# EAGLE design Pi-XMEGA (EAGLE 7.2.0)
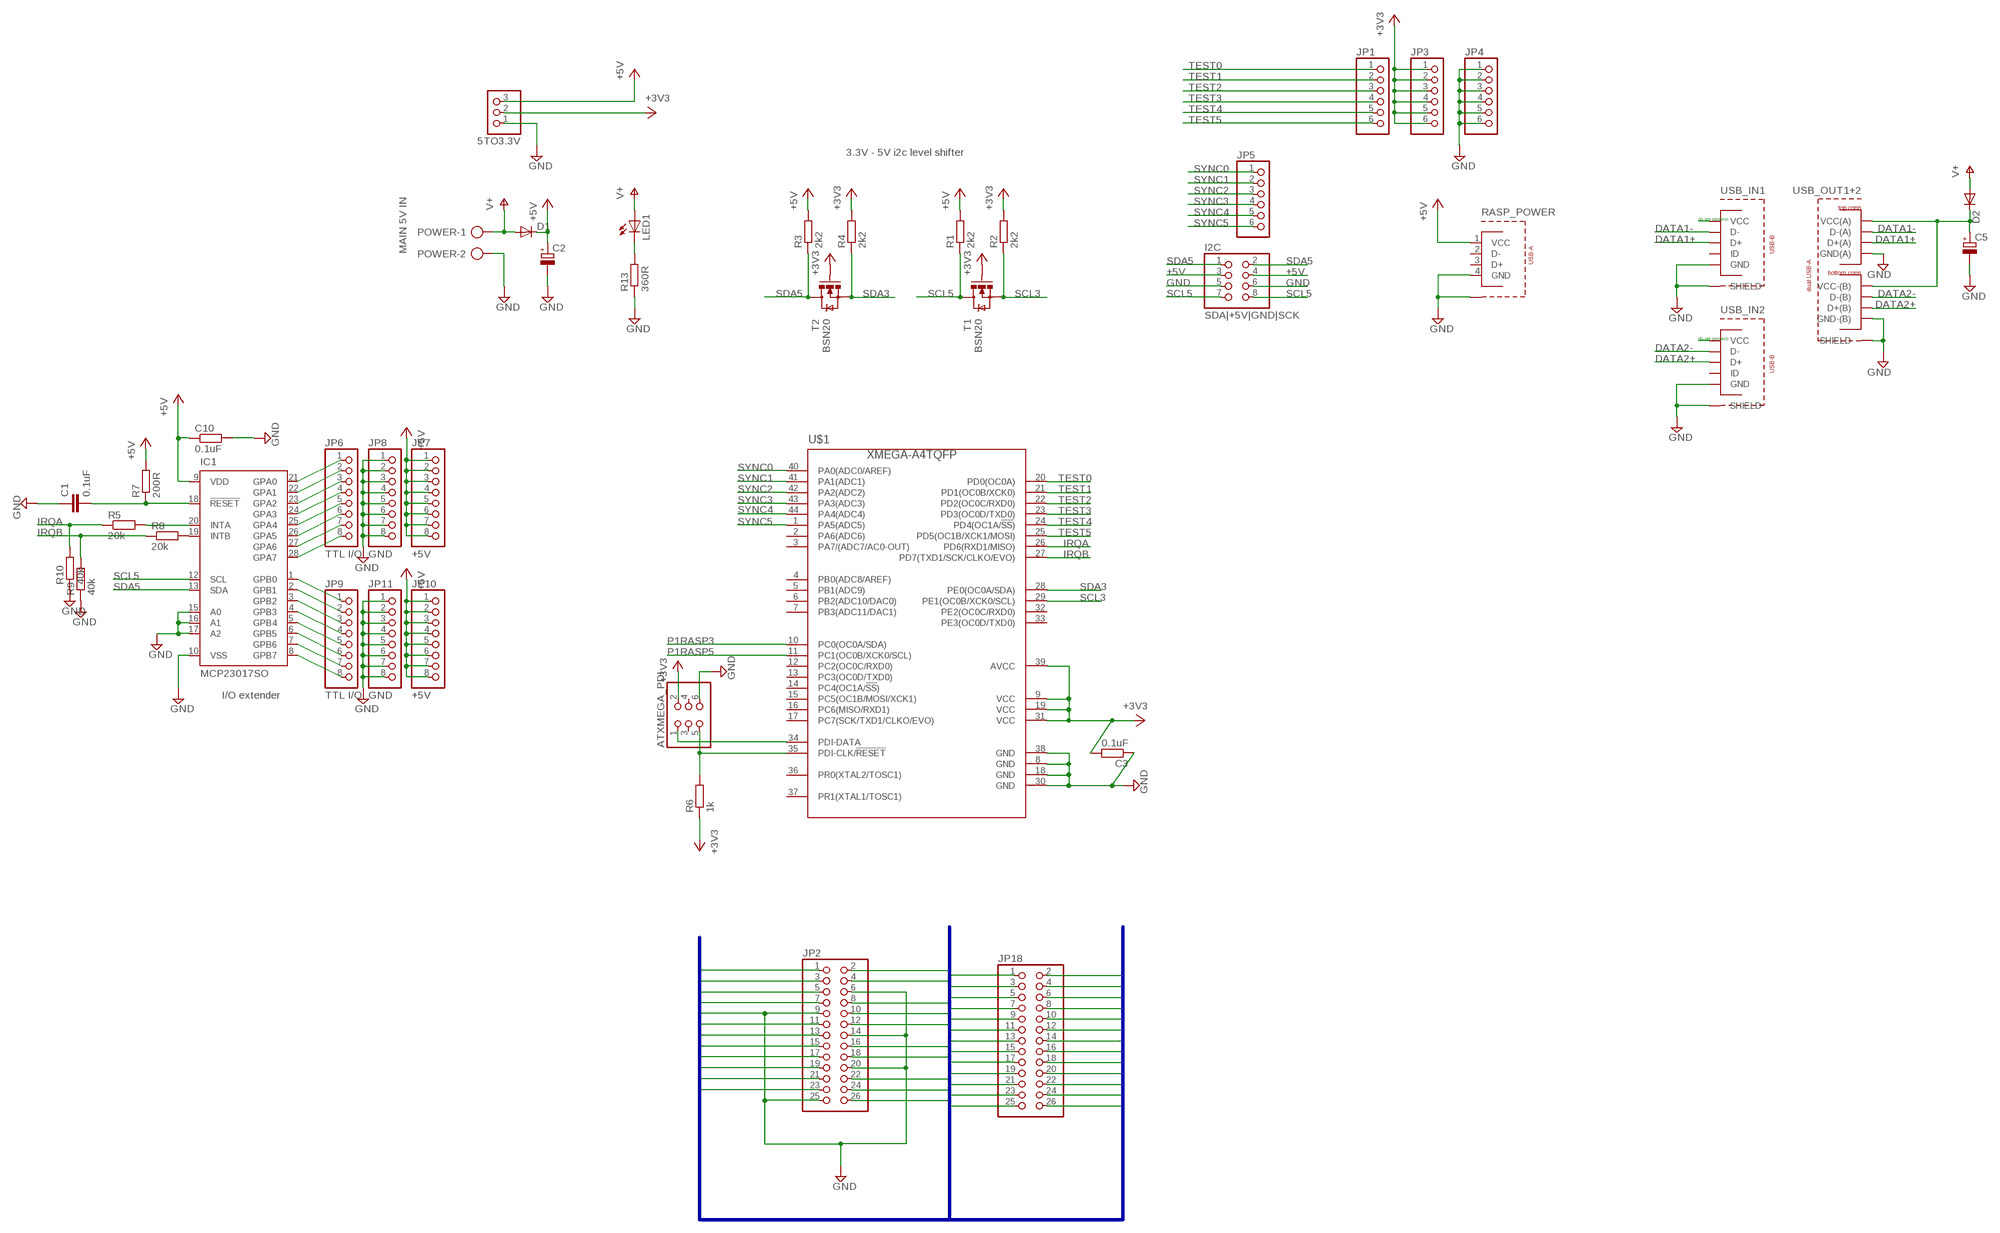
[diagram p0: schematic, sheet 1]

## Parts
5TO3.3V  PINHD-1X3  [1X03]
ATXMEGA_PDI  PINHD-2X03_2.54  [2X03]
C1  0.1uF  CAPACITORC-0805BIG  [0805BIG]
C2  CPOL-EUE5-8.5  [E5-8,5]
C3  0.1uF  RESISTORR-0805BIG  [0805BIG]
C5  CPOL-EUE5-8.5  [E5-8,5]
C10  0.1uF  RESISTORR-0805BIG  [0805BIG]
D1  DIODE-C1702-05  [C1702-05]
D2  DIODE-C1702-05  [C1702-05]
I2C  SDA|+5V|GND|SCK  PINHD-2X04_2.54  [2X04]
IC1  MCP23017SO  [SO28W]
JP1  PINHD-1X06_2.54-S  [1X06-S]
JP2  PINHD-2X13_2.54  [2X13]
JP3  PINHD-1X06_2.54-S  [1X06-S]
JP4  PINHD-1X06_2.54-S  [1X06-S]
JP5  PINHD-1X06_2.54-S  [1X06-S]
JP6  TTL I/O  PINHD-1X08_2.54-S  [1X08-S]
JP7  +5V  PINHD-1X08_2.54-S  [1X08-S]
JP8  GND  PINHD-1X08_2.54-S  [1X08-S]
JP9  TTL I/O  PINHD-1X08_2.54-S  [1X08-S]
JP10  +5V  PINHD-1X08_2.54-S  [1X08-S]
JP11  GND  PINHD-1X08_2.54-S  [1X08-S]
JP18  PINHD-2X13_2.54  [2X13]
LED1  LED3MM  [LED3MM]
POWER  AK500/2  [AK500/2]
R1  2k2  RESISTORR-0805BIG  [0805BIG]
R2  2k2  RESISTORR-0805BIG  [0805BIG]
R3  2k2  RESISTORR-0805BIG  [0805BIG]
R4  2k2  RESISTORR-0805BIG  [0805BIG]
R5  20k  RESISTORR-0805BIG  [0805BIG]
R6  1k  RESISTORR-0805BIG  [0805BIG]
R7  200R  RESISTORR-0805BIG  [0805BIG]
R8  20k  RESISTORR-0805BIG  [0805BIG]
R9  40k  RESISTORR-0805BIG  [0805BIG]
R10  40k  RESISTORR-0805BIG  [0805BIG]
R13  360R  RESISTORR-0805BIG  [0805BIG]
RASP_POWER  USB-A  [USB-A]
T1  BSN20  [SOT23]
T2  BSN20  [SOT23]
U$1  XMEGA-A4TQFP  [TQFP44]
USB_IN1  USB-B-MICRO  [USB-B-MICRO]
USB_IN2  USB-B-MICRO  [USB-B-MICRO]
USB_OUT1+2  DUAL-USB-A  [DUAL-USB-A]

## Nets
+3V3: 5TO3.3V.2 ATXMEGA_PDI.2 C3.2 JP3.1 JP3.2 JP3.3 JP3.4 JP3.5 JP3.6 R2.2 R4.2 R6.1 T1.1(G) T2.1(G) U$1.9(VCC) U$1.19(VCC) U$1.31(VCC) U$1.39(AVCC)
+5V: 5TO3.3V.3 C2.+ C10.1 D1.C I2C.3 I2C.4 IC1.9(VDD) JP7.1 JP7.2 JP7.3 JP7.4 JP7.5 JP7.6 JP7.7 JP7.8 JP10.1 JP10.2 JP10.3 JP10.4 JP10.5 JP10.6 JP10.7 JP10.8 R1.2 R3.2 R7.2 RASP_POWER.1(VCC)
DATA1+: USB_IN1.3(D+) USB_OUT1+2.3(D+(A))
DATA1-: USB_IN1.2(D-) USB_OUT1+2.2(D-(A))
DATA2+: USB_IN2.3(D+) USB_OUT1+2.7(D+(B))
DATA2-: USB_IN2.2(D-) USB_OUT1+2.6(D-(B))
GND: 5TO3.3V.1 ATXMEGA_PDI.6 C1.1 C2.- C3.1 C5.- C10.2 I2C.5 I2C.6 IC1.10(VSS) IC1.15(A0) IC1.16(A1) IC1.17(A2) JP2.6 JP2.9 JP2.14 JP2.20 JP2.25 JP4.1 JP4.2 JP4.3 JP4.4 JP4.5 JP4.6 JP8.1 JP8.2 JP8.3 JP8.4 JP8.5 JP8.6 JP8.7 JP8.8 JP11.1 JP11.2 JP11.3 JP11.4 JP11.5 JP11.6 JP11.7 JP11.8 JP18.6 JP18.9 JP18.14 JP18.20 JP18.25 POWER.2 R9.1 R10.1 R13.1 RASP_POWER.4(GND) RASP_POWER.S1(SHIELD) RASP_POWER.S2(SHIELD) U$1.8(GND) U$1.18(GND) U$1.30(GND) U$1.38(GND) USB_IN1.5(GND) USB_IN1.S1(SHIELD) USB_IN1.S2(SHIELD) USB_IN2.5(GND) USB_IN2.S1(SHIELD) USB_IN2.S2(SHIELD) USB_OUT1+2.4(GND(A)) USB_OUT1+2.8(GND-(B)) USB_OUT1+2.S1(SHIELD) USB_OUT1+2.S2(SHIELD) USB_OUT1+2.S3(SHIELD) USB_OUT1+2.S4(SHIELD)
IRQA: R5.1 R10.2 U$1.26(PD6(RXD1/MISO))
IRQB: R8.1 R9.2 U$1.27(PD7(TXD1/SCK/CLKO/EVO))
N$1: IC1.20(INTA) R5.2
N$2: IC1.19(INTB) R8.2
N$3: IC1.21(GPA0) JP6.1
N$7: IC1.22(GPA1) JP6.2
N$9: ATXMEGA_PDI.5 R6.2 U$1.35(PDI-CLK/!RESET)
N$10: IC1.23(GPA2) JP6.3
N$11: IC1.24(GPA3) JP6.4
N$12: IC1.25(GPA4) JP6.5
N$13: C1.2 IC1.18(!RESET) R7.1
N$14: IC1.26(GPA5) JP6.6
N$15: IC1.27(GPA6) JP6.7
N$16: IC1.28(GPA7) JP6.8
N$17: IC1.1(GPB0) JP9.1
N$18: IC1.2(GPB1) JP9.2
N$19: IC1.3(GPB2) JP9.3
N$20: IC1.4(GPB3) JP9.4
N$21: IC1.5(GPB4) JP9.5
N$22: IC1.6(GPB5) JP9.6
N$23: IC1.7(GPB6) JP9.7
N$24: IC1.8(GPB7) JP9.8
N$27: ATXMEGA_PDI.1 U$1.34(PDI-DATA)
N$71: LED1.K(C) R13.2
N$FAKE1: USB_IN1.1(VCC)
N$FAKE2: USB_IN2.1(VCC)
P1RASP1: JP2.1 JP18.1
P1RASP2: JP2.2 JP18.2
P1RASP3: JP2.3 JP18.3 U$1.10(PC0(OC0A/SDA))
P1RASP4: JP2.4 JP18.4
P1RASP5: JP2.5 JP18.5 U$1.11(PC1(OC0B/XCK0/SCL))
P1RASP7: JP2.7 JP18.7
P1RASP8: JP2.8 JP18.8
P1RASP10: JP2.10 JP18.10
P1RASP11: JP2.11 JP18.11
P1RASP12: JP2.12 JP18.12
P1RASP13: JP2.13 JP18.13
P1RASP15: JP2.15 JP18.15
P1RASP16: JP2.16 JP18.16
P1RASP17: JP2.17 JP18.17
P1RASP18: JP2.18 JP18.18
P1RASP19: JP2.19 JP18.19
P1RASP21: JP2.21 JP18.21
P1RASP22: JP2.22 JP18.22
P1RASP23: JP2.23 JP18.23
P1RASP24: JP2.24 JP18.24
P1RASP26: JP2.26 JP18.26
SCL3: R2.1 T1.2(S) U$1.29(PE1(OC0B/XCK0/SCL))
SCL5: I2C.7 I2C.8 IC1.12(SCL) R1.1 T1.3(D)
SDA3: R4.1 T2.2(S) U$1.28(PE0(OC0A/SDA))
SDA5: I2C.1 I2C.2 IC1.13(SDA) R3.1 T2.3(D)
SYNC0: JP5.1 U$1.40(PA0(ADC0/AREF))
SYNC1: JP5.2 U$1.41(PA1(ADC1))
SYNC2: JP5.3 U$1.42(PA2(ADC2))
SYNC3: JP5.4 U$1.43(PA3(ADC3))
SYNC4: JP5.5 U$1.44(PA4(ADC4))
SYNC5: JP5.6 U$1.1(PA5(ADC5))
TEST0: JP1.1 U$1.20(PD0(OC0A))
TEST1: JP1.2 U$1.21(PD1(OC0B/XCK0))
TEST2: JP1.3 U$1.22(PD2(OC0C/RXD0))
TEST3: JP1.4 U$1.23(PD3(OC0D/TXD0))
TEST4: JP1.5 U$1.24(PD4(OC1A/!SS!))
TEST5: JP1.6 U$1.25(PD5(OC1B/XCK1/MOSI))
USB+5V: C5.+ D2.C USB_OUT1+2.1(VCC(A)) USB_OUT1+2.5(VCC-(B))
V+: D1.A D2.A LED1.A POWER.1
Unconnected: ATXMEGA_PDI.3 ATXMEGA_PDI.4 RASP_POWER.2(D-) RASP_POWER.3(D+) U$1.2(PA6(ADC6)) U$1.3(PA7/(ADC7/AC0-OUT)) U$1.4(PB0(ADC8/AREF)) U$1.5(PB1(ADC9)) U$1.6(PB2(ADC10/DAC0)) U$1.7(PB3(ADC11/DAC1)) U$1.12(PC2(OC0C/RXD0)) U$1.13(PC3(OC0D/TXD0)) U$1.14(PC4(OC1A/!SS!)) U$1.15(PC5(OC1B/MOSI/XCK1)) U$1.16(PC6(MISO/RXD1)) U$1.17(PC7(SCK/TXD1/CLKO/EVO)) U$1.32(PE2(OC0C/RXD0)) U$1.33(PE3(OC0D/TXD0)) U$1.36(PR0(XTAL2/TOSC1)) U$1.37(PR1(XTAL1/TOSC1)) USB_IN1.4(ID) USB_IN2.4(ID)

## Buses
P1RASP[1..5],GND,P1RASP[7..8],P1RASP[10..13],P1RASP[15..16],P1RASP[17..19],P1RASP[21..24],P1RASP[26]

## Notes on the sheet
- 3.3V - 5V i2c level shifter
- do not connect!
- MAIN 5V IN
- do not connect!
- I/O extender

## Library data of the parts
5TO3.3V = pinhead:PINHD-1X3: PIN HEADER
ATXMEGA_PDI = D-pinhead-2:PINHD-2X03: PIN HEADER
C1 = D-smd:CAPACITOR
C2 C5 = rcl:CPOL-EU: POLARIZED CAPACITOR, European symbol
C3 C10 R1 R2 R4-R10 R13 = D-smd:RESISTOR: RESISTOR, European symbol
D1 D2 = diode:DIODE-: DIODE
I2C = D-pinhead-2:PINHD-2X04: PIN HEADER
IC1 = edited:MCP23017: http://ww1.microchip.com/downloads/en/DeviceDoc/21952a.pdf Source: http://ww1.microchip.com/downloads/en/DeviceDoc/21952a.pdf; MF: MICROCHIP; MPN: MCP23017-E/SO; OC_FARNELL: 1332087; OC_NEWARK: 31K2958
JP1 JP3-JP5 = D-pinhead-2:PINHD-1X06: PIN HEADER
JP2 JP18 = D-pinhead-2:PINHD-2X13: PIN HEADER
JP6-JP11 = D-pinhead-2:PINHD-1X08: PIN HEADER
LED1 = led:LED: LED OSRAM: - CHIPLED LG R971, LG N971, LY N971, LG Q971, LY Q971, LO R971, LY R971 LH N974, LH R974 LS Q976, LO Q976, LY Q976 LO Q996 - Hyper CHIPLED LW Q18S LB Q993, LB Q99A, LB R99A - SideLED LS A670, LO A670, LY A670, LG A670, LP A670 LB A673, LV A673, LT A673, LW A673 LH A674 LY A675 LS A676, LA A676, LO A676, LY A676, LW A676 LS A679, LY A679, LG A679 - Hyper Micro SIDELED® LS Y876, LA Y876, LO Y876, LY Y876 LT Y87S - SmartLED LW L88C, LW L88S LB L89C, LB L89S, LG L890 LS L89K, LO L89K, LY L89K LS L896, LA L896, LO L896, LY L896 - TOPLED LS T670, LO T670, LY T670, LG T670, LP T670 LSG T670, LSP T670, LSY T670, LOP T670, LYG T670 LG T671, LOG T671, LSG T671 LB T673, LV T673, LT T673, LW T673 LH T674 LS T676, LA T676, LO T676, LY T676, LB T676, LH T676, LSB T676, LW T676 LB T67C, LV T67C, LT T67C, LS T67K, LO T67K, LY T67K, LW E67C LS E67B, LA E67B, LO E67B, LY E67B, LB E67C, LV E67C, LT E67C LW T67C LS T679, LY T679, LG T679 LS T770, LO T770, LY T770, LG T770, LP T770 LB T773, LV T773, LT T773, LW T773 LH T774 LS E675, LA E675, LY E675, LS T675 LS T776, LA T776, LO T776, LY T776, LB T776 LHGB T686 LT T68C, LB T68C - Hyper Mini TOPLED® LB M676 - Mini TOPLED Santana® LG M470 LS M47K, LO M47K, LY M47K Source: http://www.osram.convergy.de LUXEON: - LUMILED® LXK2-PW12-R00, LXK2-PW12-S00, LXK2-PW14-U00, LXK2-PW14-V00 LXK2-PM12-R00, LXK2-PM12-S00, LXK2-PM14-U00 LXK2-PE12-Q00, LXK2-PE12-R00, LXK2-PE12-S00, LXK2-PE14-T00, LXK2-PE14-U00 LXK2-PB12-K00, LXK2-PB12-L00, LXK2-PB12-M00, LXK2-PB14-N00, LXK2-PB14-P00, LXK2-PB14-Q00 LXK2-PR12-L00, LXK2-PR12-M00, LXK2-PR14-Q00, LXK2-PR14-R00 LXK2-PD12-Q00, LXK2-PD12-R00, LXK2-PD12-S00 LXK2-PH12-R00, LXK2-PH12-S00 LXK2-PL12-P00, LXK2-PL12-Q00, LXK2-PL12-R00 Source: www.luxeon.com KINGBRIGHT: KA-3528ASYC Source: www.kingbright.com
POWER = con-ptr500:AK500/2: CONNECTOR; OC_FARNELL: unknown; OC_NEWARK: unknown
R3 = MART2013:RESISTOR: RESISTOR, European symbol
RASP_POWER = D-USB:USB-A: USB A connector
T1 T2 = edited:BSN20
U$1 = avr-7:XMEGA-A4: Atmel XMega A4 series processor
USB_IN1 USB_IN2 = D-USB:USB-B-MICRO: MICRO USB B, BOTTOM MOUNT
USB_OUT1+2 = D-USB:DUAL-USB-A: Dual USB Receptacle, Horizontal.

## Board
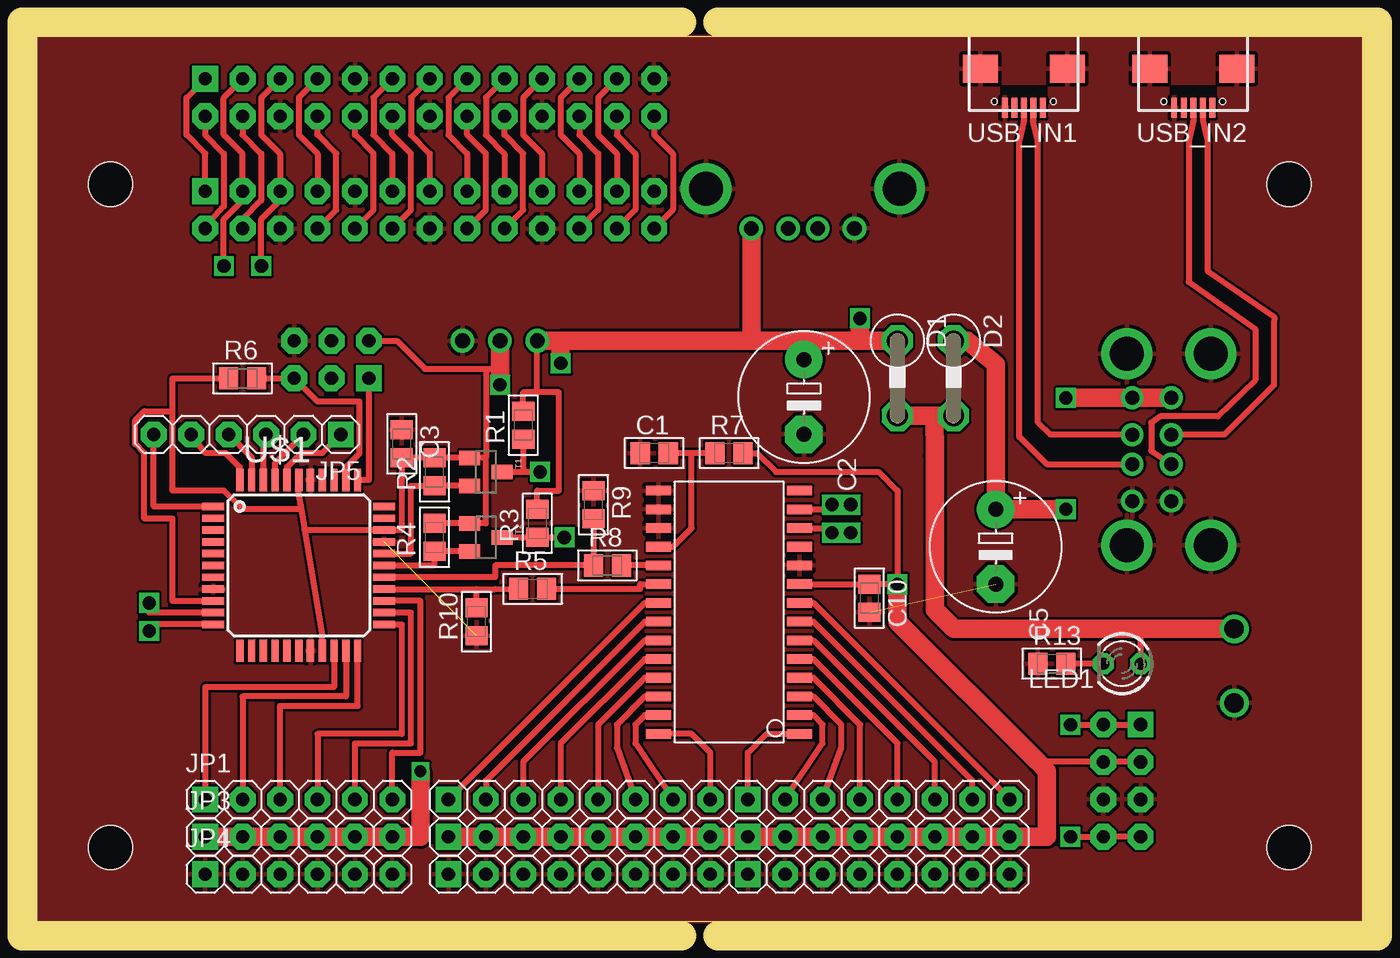
[diagram p1: board, top side]
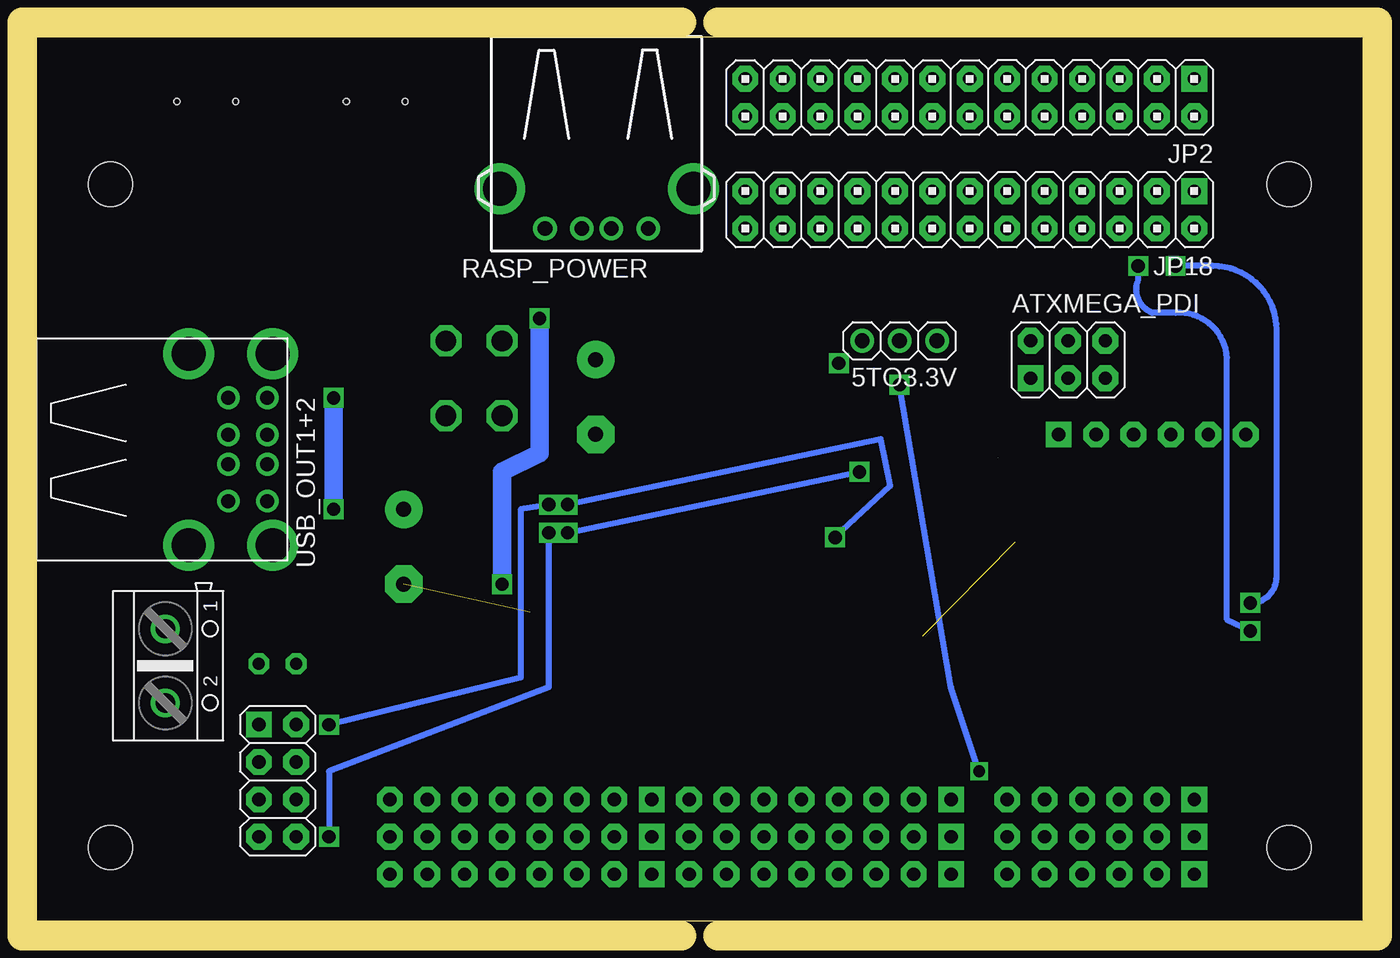
[diagram p2: board, bottom side, seen from below]

Size 90 x 60 mm. Coordinates in mm from the lower left corner, seen from the top.
Outline: 0,0 90,0 90,60 0,60 0,0
Copper layers (1*16): Top 0.035mm / dielectric 1.5mm / Bottom 0.035mm
Design rules "RAP-Expansion_Board-v8-drobnosti *": minimum track width 12mil, minimum drill 0.3mm, track to track 7mil, track to pad 7mil, pad to pad 7mil, via to via 7mil, smd to smd 7mil, copper to edge 0mil, drill to drill 8mil, minimum pad ring 0.3mm, minimum via ring 8mil, stop-mask expansion 4mil, vias tented up to drill 0mil, thermal gap 10mil
Holes 3 mm at 5,50 85,50 85,5 5,5
Milling: 6 lines

### Footprints (pad centres in the part's own frame; a part is rotated, then mirrored left to right if it is on the bottom)
1X03 = drill 1.016 long: 1 -2.54,0; 2 0,0; 3 2.54,0
2X03 = drill 0.9 pad 1.75 square: 1 -2.54,-1.27 | drill 0.9 pad 1.75 octagon: 2 -2.54,1.27; 3 0,-1.27; 4 0,1.27; 5 2.54,-1.27; 6 2.54,1.27
0805BIG = smd 1.3 x 1.5: 1 -0.95,0; 2 0.95,0
E5-8,5 = drill 1.016 pad 2.54: + -2.54,0 | drill 1.016 pad 2.54 octagon: - 2.54,0
C1702-05 = drill 1.397 octagon: A 2.54,0; C -2.54,0
2X04 = drill 0.9 pad 1.75 square: 1 -3.81,-1.27 | drill 0.9 pad 1.75 octagon: 2 -3.81,1.27; 3 -1.27,-1.27; 4 -1.27,1.27; 5 1.27,-1.27; 6 1.27,1.27; 7 3.81,-1.27; 8 3.81,1.27
SO28W = smd 0.65 x 1.7: 1 -7.62,-4.78; 2 -6.35,-4.78; 3 -5.08,-4.78; 4 -3.81,-4.78; 5 -2.54,-4.78; 6 -1.27,-4.78; 7 0,-4.78; 8 1.27,-4.78; 9 2.54,-4.78; 10 3.81,-4.78; 11 5.08,-4.78; 12 6.35,-4.78; 13 7.62,-4.78; 14 8.89,-4.78; 15 8.89,4.78; 16 7.62,4.78; 17 6.35,4.78; 18 5.08,4.78; 19 3.81,4.78; 20 2.54,4.78; 21 1.27,4.78; 22 0,4.78; 23 -1.27,4.78; 24 -2.54,4.78; 25 -3.81,4.78; 26 -5.08,4.78; 27 -6.35,4.78; 28 -7.62,4.78
1X06-S = drill 0.9 pad 1.75 square: 1 -6.35,0 | drill 0.9 pad 1.75 octagon: 2 -3.81,0; 3 -1.27,0; 4 1.27,0; 5 3.81,0; 6 6.35,0
2X13 = drill 0.9 pad 1.75 square: 1 -15.24,-1.27 | drill 0.9 pad 1.75 octagon: 2 -15.24,1.27; 3 -12.7,-1.27; 4 -12.7,1.27; 5 -10.16,-1.27; 6 -10.16,1.27; 7 -7.62,-1.27; 8 -7.62,1.27; 9 -5.08,-1.27; 10 -5.08,1.27; 11 -2.54,-1.27; 12 -2.54,1.27; 13 0,-1.27; 14 0,1.27; 15 2.54,-1.27; 16 2.54,1.27; 17 5.08,-1.27; 18 5.08,1.27; 19 7.62,-1.27; 20 7.62,1.27; 21 10.16,-1.27; 22 10.16,1.27; 23 12.7,-1.27; 24 12.7,1.27; 25 15.24,-1.27; 26 15.24,1.27
1X08-S = drill 0.9 pad 1.75 square: 1 -8.89,0 | drill 0.9 pad 1.75 octagon: 2 -6.35,0; 3 -3.81,0; 4 -1.27,0; 5 1.27,0; 6 3.81,0; 7 6.35,0; 8 8.89,0
LED3MM = drill 0.813 octagon: A -1.27,0; K 1.27,0
AK500/2 = drill 1.321 long: 1 -2.515,0; 2 2.515,0
USB-A = drill 1: 1 -3.5,13; 2 -1,13; 3 1,13; 4 3.5,13 | drill 2.3: S1 -6.57,10.3; S2 6.57,10.3
SOT23 = smd 1 x 1.4: 1 -0.95,-1.1; 2 0.95,-1.1; 3 0,1.1
TQFP44 = smd 1.5 x 0.5: 1 -5.8,4; 2 -5.8,3.2; 3 -5.8,2.4; 4 -5.8,1.6; 5 -5.8,0.8; 6 -5.8,0; 7 -5.8,-0.8; 8 -5.8,-1.6; 9 -5.8,-2.4; 10 -5.8,-3.2; 11 -5.8,-4; 23 5.8,-4; 24 5.8,-3.2; 25 5.8,-2.4; 26 5.8,-1.6; 27 5.8,-0.8; 28 5.8,0; 29 5.8,0.8; 30 5.8,1.6; 31 5.8,2.4; 32 5.8,3.2; 33 5.8,4 | smd 0.5 x 1.5: 12 -4,-5.8; 13 -3.2,-5.8; 14 -2.4,-5.8; 15 -1.6,-5.8; 16 -0.8,-5.8; 17 0,-5.8; 18 0.8,-5.8; 19 1.6,-5.8; 20 2.4,-5.8; 21 3.2,-5.8; 22 4,-5.8; 34 4,5.8; 35 3.2,5.8; 36 2.4,5.8; 37 1.6,5.8; 38 0.8,5.8; 39 0,5.8; 40 -0.8,5.8; 41 -1.6,5.8; 42 -2.4,5.8; 43 -3.2,5.8; 44 -4,5.8
USB-B-MICRO = smd 0.4 x 1.35: 1 -1.3,4.825; 2 -0.65,4.825; 3 0,4.825; 4 0.65,4.825; 5 1.3,4.825 | smd 2.375 x 1.9: S1 -2.95,2.15; S2 2.95,2.15 | hole 0.4: -2,4.4; 2,4.4
DUAL-USB-A = drill 0.95: 1 -3.5,15.65; 2 -1,15.65; 3 1,15.65; 4 3.5,15.65; 5 -3.5,13; 6 -1,13; 7 1,13; 8 3.5,13 | drill 2.3: S1 -6.5,16; S2 6.5,16; S3 -6.5,10.3; S4 6.5,10.3

### Placement (x,y rotation side)
5TO3.3V  31.43,39.37 180 bottom
ATXMEGA_PDI  20,38.1 0 bottom
C1  41.91,31.75 0 top
C2  52.07,35.56 270 top
C3  24.77,32.38 270 top
C5  65.09,25.4 270 top
C10  56.52,21.91 270 top
D1  58.42,36.83 270 top
D2  62.23,36.83 270 top
I2C  73.66,9.53 270 bottom
IC1  46.99,20.32 90 top
JP1  17.78,8.26 0 top
JP2  26.67,55.88 180 bottom
JP3  17.78,5.71 0 top
JP4  17.78,3.17 0 top
JP5  14.29,33.02 180 top
JP6  36.83,8.26 0 top
JP7  36.83,5.71 0 top
JP8  36.83,3.17 0 top
JP9  57.15,8.26 0 top
JP10  57.15,5.71 0 top
JP11  57.15,3.17 0 top
JP18  26.67,48.26 180 bottom
LED1  73.66,17.46 180 top
POWER  81.28,17.32 270 bottom
R1  33.02,33.65 90 top
R2  26.99,30.48 90 top
R3  33.97,26.98 90 top
R4  26.99,26.04 90 top
R5  33.66,22.54 0 top
R6  13.97,36.83 0 top
R7  46.99,31.75 0 top
R8  38.73,24.13 0 top
R9  37.78,28.26 270 top
R10  29.84,20.32 90 top
R13  68.9,17.46 0 top
RASP_POWER  52,60 180 bottom
T1  30.48,30.48 270 top
T2  30.48,26.04 270 top
U$1  17.78,24.13 0 top
USB_IN1  67,60 180 top
USB_IN2  78.5,60 180 top
USB_OUT1+2  90,32 270 bottom

### Tracks (layer width: path | path; a pad name or v marks a point on that pad's centre or on a via)
+3V3  (via drill 0.8, 0.9)  (1 unrouted)
  Top 0.406: R4.2 T2.1 30.48,26.98 30.48,31.43 | U$1.39 17.78,28.89 17.93,27.97 | 30.48,31.43 T1.1 R2.2 C3.2 | 30.48,37.47 30.48,31.43 | U$1.19 19.38,19.36 19.37,19.37 18.18,26.52 | 17.93,27.97 18.18,26.52 | 18.18,26.52 U$1.31 24.77,26.53 C3.2 | 17.93,27.97 13.94,27.97 12.7,29.21 9.21,29.21 9.21,34.61 | 9.21,34.61 9.21,36.83 R6.1 | U$1.9 9.21,21.73 9.21,27.3 7.3,27.3 7.3,31.75 6.67,32.38 6.67,33.97 7.3,34.61 9.21,34.61 | ATXMEGA_PDI.2 24.45,39.37 26.35,37.47 30.48,37.47 | 30.48,37.47 31.43,37.47
  Top 1.27: JP3.1 JP3.2 JP3.3 JP3.4 JP3.5 JP3.6 26.04,5.71 v26.04,10.16 | v31.43,36.39 31.43,37.47 5TO3.3V.2
  Bottom 0.406: v26.04,10.16 27.94,15.88 v31.43,36.39
+5V  (via drill 0.9)
  Top 0.406: IC1.9 C10.1 v58.42,22.86 58.42,29.21 57.15,30.48 50.16,30.48 48.9,31.75 R7.2 | R1.2 33.02,35.88 33.97,35.88 | 33.97,35.88 35.43,35.88 35.43,29.21 33.97,29.21 R3.2 | I2C.3 I2C.4 67.94,10.79 | 33.97,35.88 5TO3.3V.3
  Top 0.61: C2.+ 52.07,39.37
  Top 1.27: JP7.1 JP7.2 JP7.3 JP7.4 JP7.5 JP7.6 JP7.7 JP7.8 JP10.1 JP10.2 JP10.3 JP10.4 JP10.5 JP10.6 JP10.7 JP10.8 68.58,5.71 68.58,10.16 67.94,10.79 58.42,20.32 v58.42,22.86 | D1.C 55.88,39.37 | 55.88,39.37 52.07,39.37 48.5,39.37 | 48.5,39.37 RASP_POWER.1 | v55.88,40.89 55.88,39.37 | 48.5,39.37 35.56,39.37 | 35.56,39.37 v35.56,37.85 | 5TO3.3V.3 35.56,39.37
  Bottom 1.27: v58.42,22.86 58.42,30.48 55.88,31.75 v55.88,40.89
DATA1+
  Top 0.406: USB_IN1.3 67,54.3 66.99,54.29 66.69,53 66.69,32.86 68.55,31 USB_OUT1+2.3
DATA1-
  Top 0.406: USB_OUT1+2.2 68.79,33 67.96,33.83 67.96,53 67.63,54.29 67.65,54.31 USB_IN1.2
DATA2+
  Top 0.406: USB_IN2.3 78.5,54.29 78.19,53 78.19,43.37 82.71,40.18 82.71,36.69 80.17,34.25 76.28,34.25 75.64,33.83 75.64,31.93 USB_OUT1+2.7
DATA2-
  Top 0.406: USB_IN2.2 79.15,54.29 79.46,53 79.46,44.13 84,41 83.98,40.5 83.98,36.37 80.61,33 USB_OUT1+2.6
GND  (2 unrouted)
  pour Top: 0,60 90,60 90,0 0,0
IRQA
  Top 0.406: U$1.26 29.84,22.53 | 29.84,22.53 31.12,22.53 R5.1 | R10.2 29.84,22.53
IRQB
  Top 0.406: U$1.27 31.11,23.33 31.11,24.13 R8.1 37.78,24.45 R9.2
N$1
  Top 0.406: R5.2 40.96,22.54 40.96,22.86 IC1.20
N$2
  Top 0.406: IC1.19 R8.2
N$3
  Top 0.406: IC1.21 41.27,21.59 JP6.1
N$7
  Top 0.406: IC1.22 41.27,20.32 30.48,9.53 JP6.2
N$9
  Top 0.406: R6.2 ATXMEGA_PDI.5 19.05,35.24 21.91,35.24 21.91,31.75 20.98,30.82 U$1.35
N$10
  Top 0.406: IC1.23 41.27,19.05 33.02,10.79 JP6.3
N$11
  Top 0.406: IC1.24 41.27,17.78 35.56,12.06 JP6.4
N$12
  Top 0.406: IC1.25 41.27,16.51 38.1,13.34 JP6.5
N$13
  Top 0.406: R7.1 44.45,31.75 | 44.45,31.75 C1.2 | IC1.18 43.18,25.4 44.45,26.67 44.45,31.75
N$14
  Top 0.406: IC1.26 41.27,15.24 39.37,13.34 39.37,11.75 JP6.6
N$15
  Top 0.406: IC1.27 41.27,13.97 40.64,13.34 40.64,12.06 JP6.7
N$16
  Top 0.406: JP6.8 45.72,11.43 44.45,12.7 IC1.28
N$17
  Top 0.406: JP9.1 48.26,11.43 49.53,12.7 IC1.1
N$18
  Top 0.406: JP9.2 53.34,12.06 53.34,13.34 52.7,13.97 IC1.2
N$19
  Top 0.406: JP9.3 54.61,11.75 54.61,13.34 52.7,15.24 IC1.3
N$20
  Top 0.406: 55.88,7.94 JP9.4 55.88,13.34 52.7,16.51 IC1.4
N$21
  Top 0.406: JP9.5 58.42,12.06 52.7,17.78 IC1.5
N$22
  Top 0.406: JP9.6 60.96,10.79 52.7,19.05 IC1.6
N$23
  Top 0.406: JP9.7 63.5,9.53 52.7,20.32 IC1.7
N$24
  Top 0.406: JP9.8 52.7,21.59 IC1.8
N$27
  Top 0.406: U$1.34 22.54,29.93 ATXMEGA_PDI.1
N$71
  Top 0.406: LED1.K R13.2
P1RASP1
  Top 0.406: JP18.1 11.43,52.07 10.16,53.34 10.16,55.88 JP2.1
P1RASP2
  Top 0.406: JP2.2 11.43,53.34 12.7,52.07 12.7,48.49 11.43,47.12 JP18.2
P1RASP3  (via drill 0.9)
  Top 0.406: JP2.3 12.7,55.88 12.7,53.34 13.97,52.07 JP18.3 13.97,48.9 12.7,47.62 v12.7,44.45 | U$1.10 7.62,20.93 v7.62,21.59
  Bottom 0.406: v7.62,21.59 arc-90 5.84,23.37 5.84,40.13 arc-90 10.16,44.45 v12.7,44.45
P1RASP4
  Top 0.406: JP2.4 13.97,53.34 15.24,52.07 15.24,48.9 13.97,47.62 JP18.4
P1RASP5  (via drill 0.9)
  Top 0.406: JP2.5 15.24,55.88 15.24,53.34 16.51,52.07 JP18.5 16.51,48.9 15.24,47.62 v15.24,44.45 | U$1.11 7.62,20.13 v7.62,19.68
  Bottom 0.406: v7.62,19.68 9.21,20.45 9.21,38.23 arc-90 12.7,41.27 14.29,41.27 arc90 15.24,43.5 v15.24,44.45
P1RASP7
  Top 0.406: JP2.7 17.78,55.88 17.78,53.34 19.05,52.07 JP18.7
P1RASP8
  Top 0.406: JP18.8 20.32,48.26 20.32,52.07 19.05,53.34 JP2.8
P1RASP10
  Top 0.406: JP18.10 22.86,48.26 22.86,52.07 21.59,53.34 JP2.10
P1RASP11
  Top 0.406: JP2.11 22.86,55.88 22.86,53.34 24.13,52.07 JP18.11
P1RASP12
  Top 0.406: JP18.12 25.4,48.26 25.4,52.07 24.13,53.34 JP2.12
P1RASP13
  Top 0.406: JP2.13 25.4,55.88 25.4,53.34 26.67,52.07 JP18.13
P1RASP15
  Top 0.406: JP2.15 27.94,55.88 27.94,53.34 29.21,52.07 JP18.15
P1RASP16
  Top 0.406: JP18.16 30.48,48.26 30.48,52.07 29.21,53.34 JP2.16
P1RASP17
  Top 0.406: JP2.17 30.48,55.88 30.48,53.34 31.75,52.07 JP18.17
P1RASP18
  Top 0.406: JP18.18 33.02,48.26 33.02,52.07 31.75,53.34 JP2.18
P1RASP19
  Top 0.406: JP2.19 33.02,55.88 33.02,53.34 34.29,52.07 JP18.19
P1RASP21
  Top 0.406: JP2.21 35.56,55.88 35.56,53.34 36.83,52.07 JP18.21
P1RASP22
  Top 0.406: JP2.22 36.83,53.34 38.1,52.07 38.1,48.26 JP18.22
P1RASP23
  Top 0.406: JP2.23 38.1,55.88 38.1,53.34 39.37,52.07 JP18.23
P1RASP24
  Top 0.406: JP2.24 39.37,53.34 40.64,52.07 40.64,48.26 JP18.24
P1RASP26
  Top 0.406: JP2.26 41.91,53.34 43.18,52.07 43.18,48.26 JP18.26
SCL3
  Top 0.406: T1.2 R2.1 25.4,29.53 25.4,24.93 U$1.29
SCL5  (via drill 0.9)
  Top 0.406: IC1.12 53.66,26.67 v53.98,26.35 v55.24,26.35 | T1.3 33.02,30.48 | 33.02,30.48 v34.16,30.48 | R1.1 33.02,30.48 | I2C.7 I2C.8 v70.17,5.71
  Bottom 0.406: v55.24,26.35 55.24,15.88 70.17,10.16 v70.17,5.71 | v53.98,26.35 v34.16,30.48
SDA3
  Top 0.406: T2.2 R4.1 26.99,24.13 U$1.28
SDA5  (via drill 0.9)
  Top 0.406: R3.1 33.98,26.36 | T2.3 R3.1 | IC1.13 53.5,27.94 v53.98,28.26 v55.24,28.26 | R3.1 v35.81,26.04 | v70.17,13.32 70.18,13.34 I2C.2 I2C.1
  Bottom 0.406: v35.81,26.04 32.07,29.53 32.7,32.7 v53.98,28.26 | v55.24,28.26 57.15,27.94 57.15,16.51 v70.17,13.32
SYNC0
  Top 0.406: U$1.40 16.98,30.8 17.93,31.75 19.37,31.75 JP5.1
SYNC1
  Top 0.406: U$1.41 16.18,31.1 JP5.2
SYNC2
  Top 0.406: JP5.3 15.38,32.84 U$1.42
SYNC3
  Top 0.406: U$1.43 14.61,29.93 14.61,31.43 JP5.4
SYNC4
  Top 0.406: U$1.44 13.78,30.8 12.83,31.75 11.43,31.75 JP5.5
SYNC5
  Top 0.406: U$1.1 7.94,28.13 JP5.6
TEST0
  Top 0.406: U$1.20 20.18,15.88 11.43,15.88 JP1.1
TEST1
  Top 0.406: U$1.21 20.98,15.24 13.97,15.24 JP1.2
TEST2
  Top 0.406: JP1.3 16.51,14.61 21.78,14.61 U$1.22
TEST3
  Top 0.406: U$1.23 24.77,20.13 24.77,12.7 19.05,12.7 JP1.4
TEST4
  Top 0.406: JP1.5 21.59,12.06 25.4,12.06 25.4,20.93 U$1.24
TEST5
  Top 0.406: JP1.6 24.13,11.43 26.04,11.43 26.04,21.73 U$1.25
USB+5V  (via drill 0.9)
  Top 1.27: USB_OUT1+2.5 USB_OUT1+2.1 v69.85,35.5 | D2.C 63.18,39.37 65.09,37.78 C5.+ v69.85,27.94
  Bottom 1.27: v69.85,35.5 v69.85,27.94
V+
  Top 0.406: LED1.A 74.93,19.84
  Top 0.61: 60.96,21.13 60.96,34.29
  Top 1.27: D2.A 60.96,34.29 60.94,34.29 | 60.94,34.29 60.96,31.61 60.96,21.13 62.26,19.84 74.93,19.84 POWER.1 | 60.94,34.29 D1.A

### Text on the board
tValues: 1 | 8
Document: A-B aspon 6mm cista mezera / B-B aspon 5mm cista mezera / A sirka kabel 18.1mm nebo 0.6"=15.2mm deska 13.1 / B sirka kabel 0.45"=11.43mm nebo 10.5mm, deska 7.4